# Altium schematic sheet S01.SchDoc: IEEE-1394/Ethernet FPGA Controller
size 381 x 254 mm; Revision: 2.1; SheetNumber: 1; SheetTotal: 6; PageSetup: Record=PageOptions|CenterHorizontal=True|CenterVertical=True|PrintScale=1.08|XCorrection=1.00|YCorrection=1.00|PrintKind=1|BorderSize=5000000|LeftOffset=0|BottomOffset=0|Orientation=2|PaperLength=1000|PaperWidth=1000|Scale=100|PaperSource=7|PrintQuality=600|MediaType=1|DitherType=10|PrintScaleMode=1|PaperKind=Ledger|PaperIndex=3
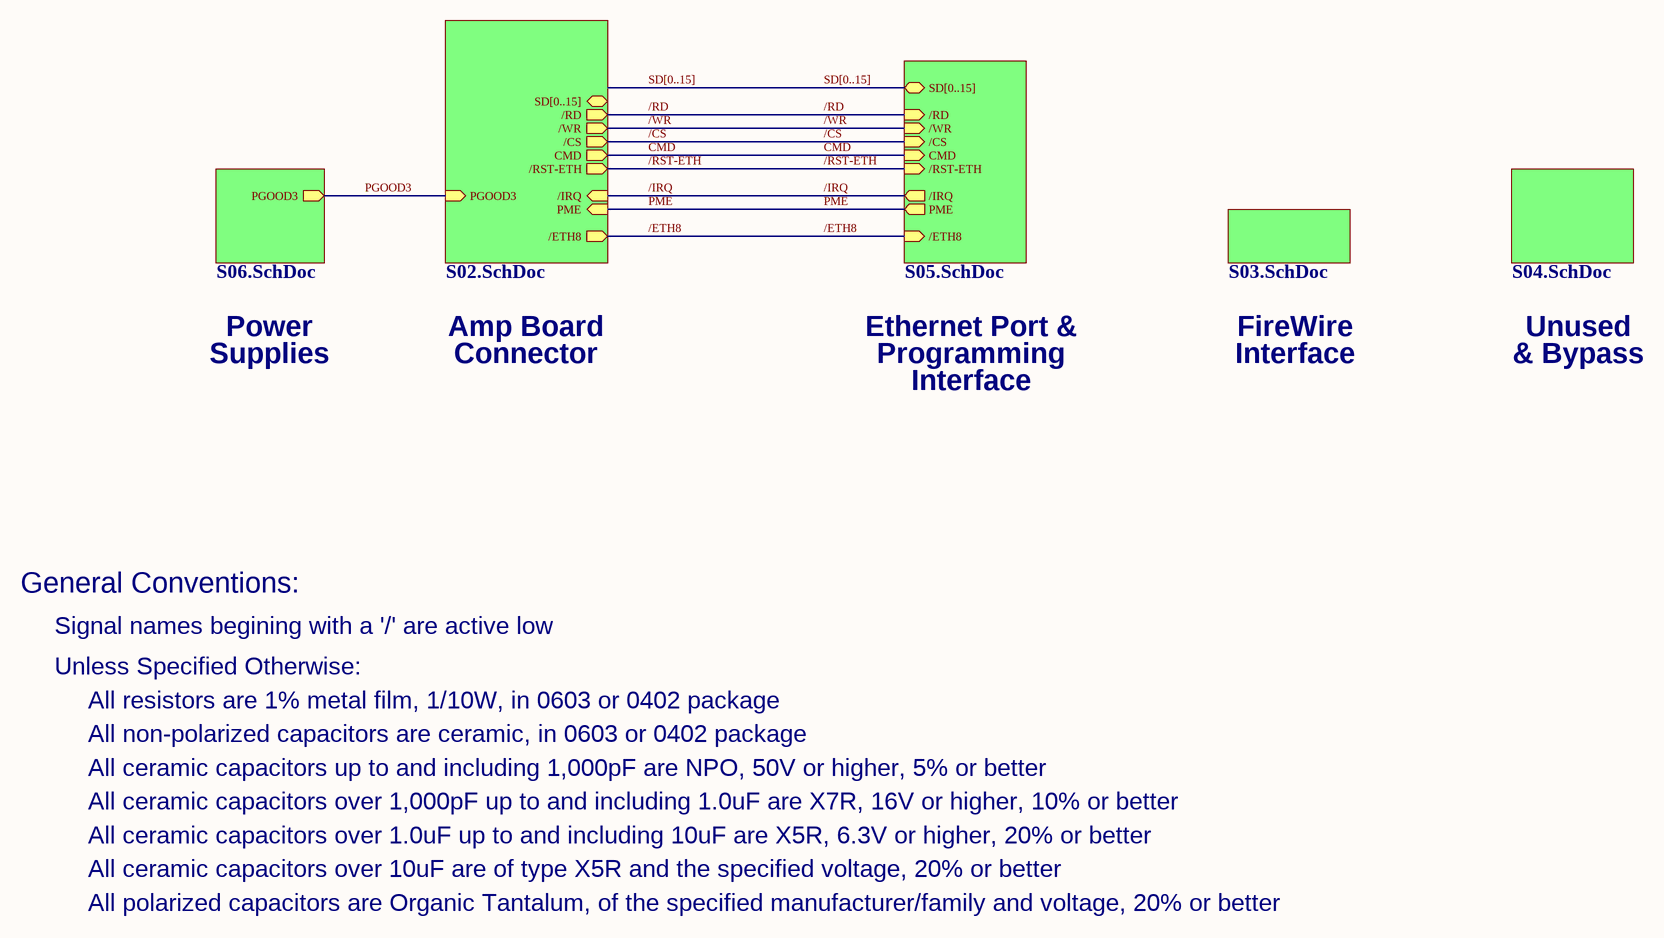
[diagram p0: S01.SchDoc]

## Sub-sheets
U_S02 = S02.SchDoc: CMD (out), /IRQ (in), /RD (out), /WR (out), /CS (out), /RST-ETH (out), PME (in), SD[0..15] (bidir), PGOOD3 (in), /ETH8 (out)
U_S03 = S03.SchDoc: no entries
U_S04 = S04.SchDoc: no entries
U_S05 = S05.SchDoc: CMD (in), /IRQ (out), /RD (in), /WR (in), /CS (in), /RST-ETH (in), PME (out), SD[0..15] (bidir), /ETH8 (in)
U_S06 = S06.SchDoc: PGOOD3 (out)

## Nets
/CS: sheet U_S02//CS, sheet U_S05//CS
/ETH8: sheet U_S02//ETH8, sheet U_S05//ETH8
/IRQ: sheet U_S02//IRQ, sheet U_S05//IRQ
/RD: sheet U_S02//RD, sheet U_S05//RD
/RST-ETH: sheet U_S02//RST-ETH, sheet U_S05//RST-ETH
/WR: sheet U_S02//WR, sheet U_S05//WR
CMD: sheet U_S02/CMD, sheet U_S05/CMD
PGOOD3: sheet U_S02/PGOOD3, sheet U_S06/PGOOD3
PME: sheet U_S02/PME, sheet U_S05/PME

## Buses and harness runs
bus SD[0..15] = sheet U_S05/SD[0..15]

## Notes on the sheet
- Power
- Supplies
- Amp Board
- Connector
- Ethernet Port &
- Programming
- FireWire
- Interface
- Unused
- & Bypass
- General Conventions:
- Signal names begining with a '/' are active low
- Unless Specified Otherwise:
- All resistors are 1% metal film, 1/10W, in 0603 or 0402 package
- All non-polarized capacitors are ceramic, in 0603 or 0402 package
- All ceramic capacitors up to and including 1,000pF are NPO, 50V or higher, 5% or better
- All ceramic capacitors over 1,000pF up to and including 1.0uF are X7R, 16V or higher, 10% or better
- All ceramic capacitors over 10uF are of type X5R and the specified voltage, 20% or better
- All polarized capacitors are Organic Tantalum, of the specified manufacturer/family and voltage, 20% or better
- All ceramic capacitors over 1.0uF up to and including 10uF are X5R, 6.3V or higher, 20% or better
- 1
- 2
- 3
- 4
- 5
- A
- B
- C
- Drawing Title:
- D
- E
- Sheet:
- Rev:
- F
- Title:
- Computational
- Sensing + Robotics
- L A B O R A T O R Y   F O R
- Part No:
- Print Date:
- THE JOHNS HOPKINS UNIVERSITY
- h t t p : / / l c s r . j h u . e d u
- File Name:
- Sheet
- of